# Altium schematic sheet CanTransceiver.SchDoc
size A4; Author: Pablo R Nava; DrawnBy: Pablo R Nava; Engineer: Pablo R Nava
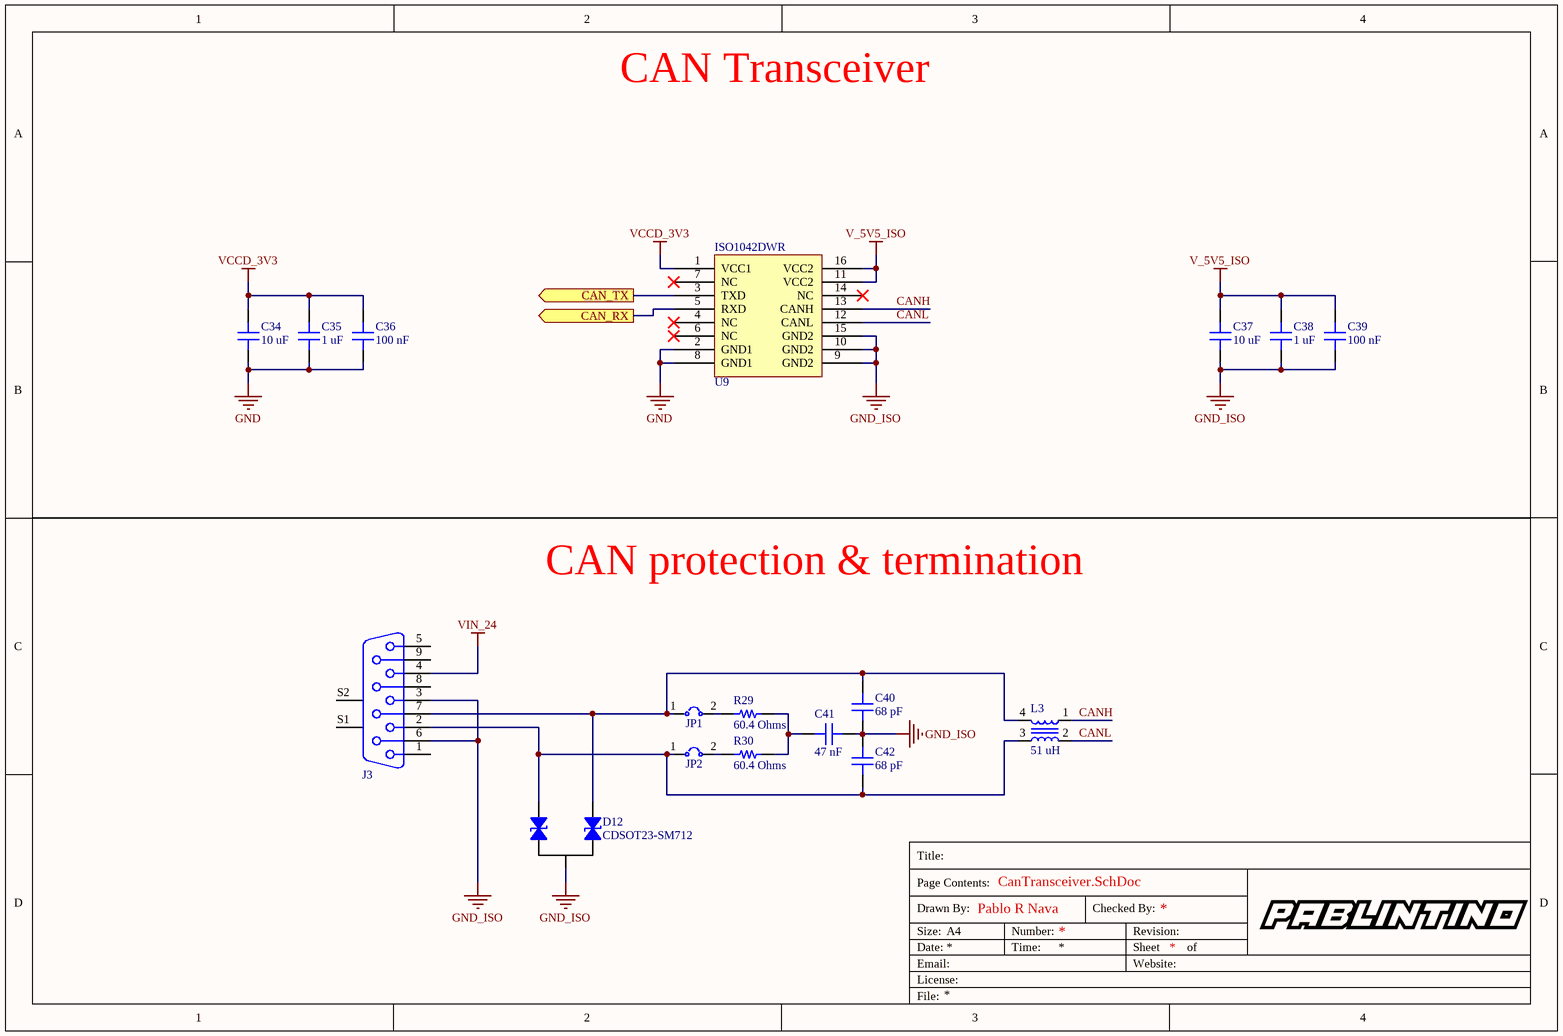
[diagram p0: CanTransceiver.SchDoc]

## Parts
C34  10 uF  [CAP 0805_2012]
C35  1 uF  [CAP 0603_1608]
C36  100 nF  [CAP 0603_1608]
C37  10 uF  [CAP 0805_2012]
C38  1 uF  [CAP 0603_1608]
C39  100 nF  [CAP 0603_1608]
C40  68 pF  [CAP 0603_1608]
C41  47 nF  [CAP 0805_2012]
C42  68 pF  [CAP 0603_1608]
D12  CDSOT23-SM712  [BOURNS SOT-23-3]
J3  09681537613  [DSUB9]  (value not drawn)
JP1  61300211121  [JUMPER-100]  (value not drawn)
JP2  61300211121  [JUMPER-100]  (value not drawn)
L3  51 uH  [TDK_ACT45B]
R29  60.4 Ohms  [RES 0805_2012]
R30  60.4 Ohms  [RES 0805_2012]
U9  ISO1042DWR  [TI-DW16_N]

## Ports
CAN_RX (out), CAN_TX (out)

## Nets
GND: C34.2 C35.1 C36.2 U9.2(GND1) U9.8(GND1)
GND_ISO: C37.2 C38.1 C39.2 C40.2 C41.1 C42.1 D12.3 J3.3 J3.6 U9.9(GND2) U9.10(GND2) U9.15(GND2)
V_5V5_ISO: C37.1 C38.2 C39.1 U9.11(VCC2) U9.16(VCC2)
VCCD_3V3: C34.1 C35.2 C36.1 U9.1(VCC1)
VIN_24: J3.4
CAN_RX: U9.5(RXD) ; port CAN_RX
CAN_TX: U9.3(TXD) ; port CAN_TX
CANH: L3.1 U9.13(CANH)
CANL: L3.2 U9.12(CANL)
NetC40_1: C40.1 D12.2 J3.7 JP1.1(A) L3.4
NetC41_2: C41.2 R29.1 R30.1
NetC42_2: C42.2 D12.1 J3.2 JP2.1(A) L3.3
NetJP1_2: JP1.2(K) R29.2
NetJP2_2: JP2.2(K) R30.2

Not connected (* = marked no-connect by the designer): J3 1 5 8 9 S1 S2; U9 4(NC)* 6(NC)* 7(NC)* 14(NC)*

## Notes on the sheet
- CAN Transceiver
- CAN protection & termination
- Title:
- Drawn By:
- Page Contents:
- Checked By:
- Size:
- Date:
- File:
- License:
- Email:
- A4
- Number:
- Time:
- Revision:
- Sheet
- Website:
- of

## Library data of the parts
C34 C37 = 0805YC106MAT2A: MLCC Ceramic 10 uF 25 V 20% Capacitor; Manufacturer: AVX; Voltage: 16 V; Type: capacitor_ceramic; Through Hole: 0; Part Number: 0805YC106MAT2A; Value: 10 uF; Tolerance: 20%; Composition: X7R; Created On: 22/06/2020 21:37:18; Updated On: 22/06/2020 21:37:31; Package: 0805 (2012 Metric)
C35 C38 = 06033C105KAT4A: MLCC Ceramic 1 uF 25 V 10% Capacitor; Manufacturer: AVX; Voltage: 25 V; Type: capacitor_ceramic; Through Hole: 0; Part Number: 06033C105KAT4A; Value: 1 uF; Tolerance: 10%; Composition: X7R; Created On: 22/06/2020 21:33:54; Updated On: 22/06/2020 21:34:12; Package: 0603 (1608 Metric)
C36 C39 = 06035C104K4Z2A: MLCC Ceramic 100 nF 50 V 10% Capacitor; Manufacturer: AVX; Voltage: 50 V; Type: capacitor_ceramic; Through Hole: 0; Part Number: 06035C104K4Z2A; Value: 100 nF; Tolerance: 10%; Composition: X7R; Created On: 22/06/2020 21:28:51; Updated On: 22/06/2020 21:29:02; Package: 0603 (1608 Metric)
C40 C42 = 06031U680GAT2A: MLCC Ceramic 68 pF 100 V 2% Capacitor; Manufacturer: AVX; Voltage: 100 V; Type: capacitor_ceramic; Through Hole: 0; Part Number: 06031U680GAT2A; Value: 68 pF; Tolerance: 2%; Composition: NP0; Created On: 23/06/2020 20:31:11; Updated On: 23/06/2020 20:32:22; Package: 0603 (1608 Metric)
C41 = C2012X7R2A473K125AA: MLCC Ceramic 47 nF 100 V 10% Capacitor; Manufacturer: TDK; Voltage: 200 V; Type: capacitor_ceramic; Through Hole: 0; Part Number: C2012X7R2A473K125AA; Value: 47 nF; Tolerance: 10%; Composition: X7R; Created On: 31/05/2020 9:04:57; Updated On: 31/05/2020 9:07:12; Package: 0805 (2012 Metric)
D12 = CDSOT23-SM712: CAN bus TVS diode; Manufacturer: Bourns; Standoff Reverse Voltage: 13.3 V; Minimum Breakdown Voltage: 12 V; Maximum Clamping Voltage: 26 V; Type: diode_tvs; Through Hole: 0; Part Number: CDSOT23-SM712; Created On: 22/06/2020 21:57:13; Updated On: 22/06/2020 21:57:43; Package: SOT-23
J3 = 09681537613: DSUB SV FE SSDP ANG-US 09P AU3; Manufacturer: Harting; Pitch: 2.77 mm; Current Rating: 6 A; Number of Contacts: 9; Through Hole: 1; Part Number: 09681537613; Orientation: right; Number of Rows: 2; Created On: 18/07/2020 11:53:48; Updated On: 18/07/2020 11:54:47; Type: connector_pcb; Package: Through Hole
JP1 JP2 = 61300211121: Connector Header Through Hole 2 position 0.100 (2.54mm); Manufacturer: Würth Elektronik; Pitch: 100 mil; Voltage Rating: 250 V; Current Rating: 3 A; Number of Contacts: 2; Through Hole: 1; Part Number: 61300211121; Orientation: straight; Number of Rows: 1; Created On: 19/07/2020 13:40:52; Updated On: 19/07/2020 13:41:17; Type: connector_pcb; Package: Through Hole
L3 = ACT45B-510-2P-TL003: CAN Bus Common Choke; Manufacturer: TDK; Number of Lines: 2; DC Resistance: 1 Ohms; Impedance Frequency: 2800 Ohms @ 10 MHz; Current Rating: 200 mA; Type: inductor_choke; Through Hole: 0; Part Number: ACT45B-510-2P-TL003; Value: 51 uH; Created On: 23/06/2020 19:40:24; Updated On: 23/06/2020 20:05:36; Package: ACT45B
R29 R30 = CRCW080560R4FKEA: Thin Film Resistor 60.4 Ohms 1%; Manufacturer: Vishay / Dale; Power Max: 125 mW; Through Hole: 0; Part Number: CRCW080560R4FKEA; Value: 60.4 Ohms; Tolerance: 1%; Created On: 19/05/2020 17:44:54; Updated On: 19/05/2020 17:46:42; Type: resistor; Package: 0805 (2012 Metric)
U9 = ISO1042DWR: Isolated CAN FD Transceiver; Manufacturer: Texas Instruments; Duplex: Full-Duplex; Data Rate: 5Mbps; Supply Voltage: 5 V; Through Hole: 0; Part Number: ISO1042DWR; Protocol: CAN; Created On: 22/06/2020 19:10:03; Updated On: 22/06/2020 19:54:36; Type: transceiver; Package: SOIC-16